# Altium schematic sheet AMS_Slave.SchDoc
size A4; DocumentNumber: 1; SheetNumber: 1; SheetTotal: 6
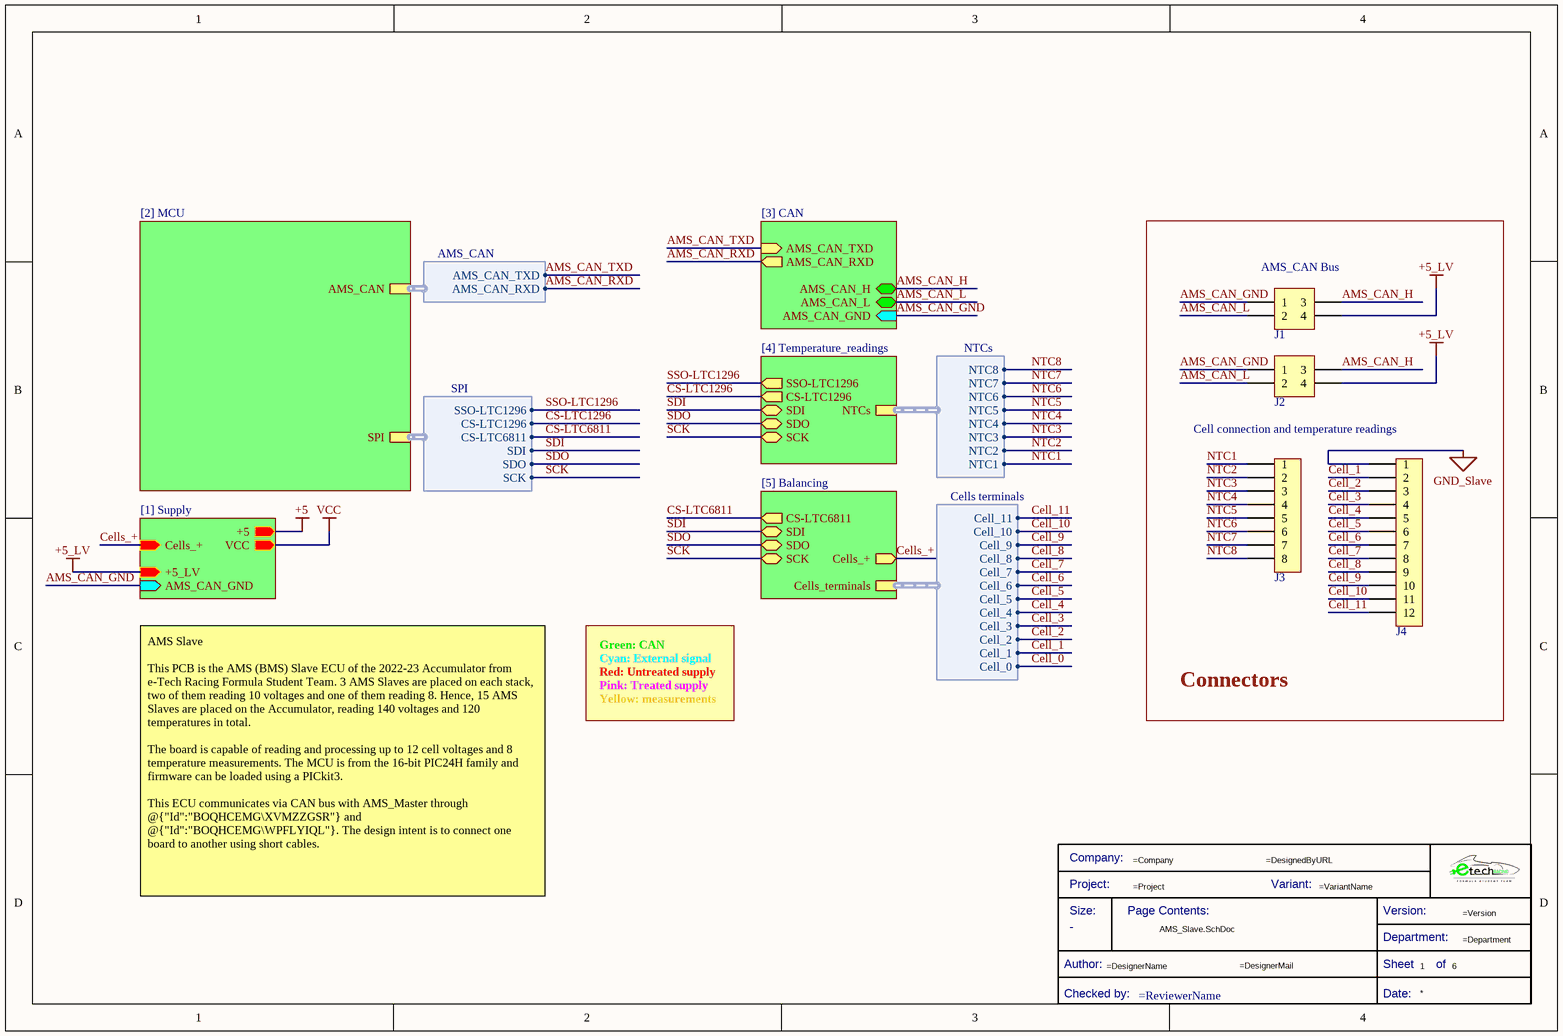
[diagram p0: AMS_Slave.SchDoc]

## Parts
*  Title Block_template  (value not drawn)  (graphical)
J1  430450412  [J_MicroFit_2x2_v]  (value not drawn)
J2  430450412  [J_MicroFit_2x2_v]  (value not drawn)
J3  J_MicroFit_1x8_V  [J_MicroFit_1x8_V]  (value not drawn)
J4  J_MicroFit_1x12_V  [J_MicroFit_1x12_V]  (value not drawn)

## Blocks framed on the sheet
Connectors: J1-J4

## Sub-sheets
Balancing = [5] Balancing: SDI (bidir), SDO (bidir), SCK (bidir), CS-LTC6811 (out), Cells_terminals (harness Cells terminals), Cells_+ (out)
CAN = [3] CAN: AMS_CAN_TXD (in), AMS_CAN_RXD (out), AMS_CAN_H (bidir), AMS_CAN_L (bidir), AMS_CAN_GND (in)
MCU = [2] MCU: AMS_CAN (harness AMS_CAN), SPI (harness SPI)
Supply = [1] Supply: Cells_+ (in), +5 (out), VCC (out), +5_LV (in), AMS_CAN_GND (in)
Temperature_readings = [4] Temperature_readings: CS-LTC1296 (out), SDI (bidir), SDO (bidir), SCK (bidir), SSO-LTC1296 (out), NTCs (harness NTCs)

## Harnesses
AMS_CAN: AMS_CAN_TXD, AMS_CAN_RXD
SPI: SCK, SDI, SDO, SSO-LTC1296, CS-LTC1296, CS-LTC6811
Cells terminals: Cell_0, Cell_1, Cell_10, Cell_11, Cell_2, Cell_3, Cell_4, Cell_5, Cell_6, Cell_7, Cell_8, Cell_9
NTCs: NTC2, NTC3, NTC4, NTC5, NTC6, NTC7, NTC8, NTC1

## Nets
+5: sheet Supply/+5
+5_LV: J1.4 J2.4 ; sheet Supply/+5_LV
GND_Slave: J4.1
VCC: sheet Supply/VCC
AMS_CAN_GND: J1.1 J2.1 ; sheet CAN/AMS_CAN_GND, sheet Supply/AMS_CAN_GND
AMS_CAN_H: J1.3 J2.3 ; sheet CAN/AMS_CAN_H
AMS_CAN_L: J1.2 J2.2 ; sheet CAN/AMS_CAN_L
AMS_CAN_RXD: sheet CAN/AMS_CAN_RXD, sheet MCU/AMS_CAN.AMS_CAN_RXD
AMS_CAN_TXD: sheet CAN/AMS_CAN_TXD, sheet MCU/AMS_CAN.AMS_CAN_TXD
Cell_0: sheet Balancing/Cells_terminals.Cell_0
Cell_1: J4.2 ; sheet Balancing/Cells_terminals.Cell_1
Cell_2: J4.3 ; sheet Balancing/Cells_terminals.Cell_2
Cell_3: J4.4 ; sheet Balancing/Cells_terminals.Cell_3
Cell_4: J4.5 ; sheet Balancing/Cells_terminals.Cell_4
Cell_5: J4.6 ; sheet Balancing/Cells_terminals.Cell_5
Cell_6: J4.7 ; sheet Balancing/Cells_terminals.Cell_6
Cell_7: J4.8 ; sheet Balancing/Cells_terminals.Cell_7
Cell_8: J4.9 ; sheet Balancing/Cells_terminals.Cell_8
Cell_9: J4.10 ; sheet Balancing/Cells_terminals.Cell_9
Cell_10: J4.11 ; sheet Balancing/Cells_terminals.Cell_10
Cell_11: J4.12 ; sheet Balancing/Cells_terminals.Cell_11
Cells_+: sheet Balancing/Cells_+, sheet Supply/Cells_+
CS-LTC1296: sheet Temperature_readings/CS-LTC1296, sheet MCU/SPI.CS-LTC1296
CS-LTC6811: sheet Balancing/CS-LTC6811, sheet MCU/SPI.CS-LTC6811
NTC1: J3.1 ; sheet Temperature_readings/NTCs.NTC1
NTC2: J3.2 ; sheet Temperature_readings/NTCs.NTC2
NTC3: J3.3 ; sheet Temperature_readings/NTCs.NTC3
NTC4: J3.4 ; sheet Temperature_readings/NTCs.NTC4
NTC5: J3.5 ; sheet Temperature_readings/NTCs.NTC5
NTC6: J3.6 ; sheet Temperature_readings/NTCs.NTC6
NTC7: J3.7 ; sheet Temperature_readings/NTCs.NTC7
NTC8: J3.8 ; sheet Temperature_readings/NTCs.NTC8
SCK: sheet Temperature_readings/SCK, sheet Balancing/SCK, sheet MCU/SPI.SCK
SDI: sheet Temperature_readings/SDI, sheet Balancing/SDI, sheet MCU/SPI.SDI
SDO: sheet Temperature_readings/SDO, sheet Balancing/SDO, sheet MCU/SPI.SDO
SSO-LTC1296: sheet Temperature_readings/SSO-LTC1296, sheet MCU/SPI.SSO-LTC1296

## Notes on the sheet
- (near J1) AMS_CAN Bus
- Cell connection and temperature readings
- Green: CAN
- Cyan: External signal
- Red: Untreated supply
- Yellow: measurements
- Pink: Treated supply
- AMS Slave
  This PCB is the AMS (BMS) Slave ECU of the 2022-23 Accumulator from e-Tech Racing Formula Student Team. 3 AMS Slaves are placed on each stack, two of them reading 10 voltages and one of them reading 8. Hence, 15 AMS Slaves are placed on the Accumulator, reading 140 voltages and 120 temperatures in total.
  The board is capable of reading and processing up to 12 cell voltages and 8 temperature measurements. The MCU is from the 16-bit PIC24H family and firmware can be loaded using a PICkit3.
  This ECU communicates via CAN bus with AMS_Master through @{"Id":"BOQHCEMG\XVMZZGSR"} and @{"Id":"BOQHCEMG\WPFLYIQL"}. The design intent is to connect one board to another using short cables.
- Title
- Size:
- Date:
- A4
- Number:
- Time:
- Revision:
- Sheet
- of
- File:
- (in symbol Title Block_template) Company:; Project:; Variant:; Size:; Page Contents:; Version:; Department:; Author:; Sheet; of; Checked by:; Date:

## Library data of the parts
* = Title Block_template: Standard Title Block; Category: Title Block; Checked by:: =ReviewerName; Size: -
J1 J2 = J_MicroFit_2x2: Header 2 Row Vertical Polarizing Peg 4 Pin Tin Plate SMT/Glow Wire Kinked Leads; Manufacturer 1: Molex; Manufacturer Part Number 1: 43045-0412; .Creator: DR; Supplier 1: Arrow Electronics; RoHS: Yes; Category: Headers and Wire Housings; Stock 1: 54122; Pricing 1: 1=1,24720, 10=1,02970, 80=0,85390, 2232=0,63810, 6696=0,59030, 11160=0,55550 (USD); ComponentLink1URL: https://datasheet.ciiva.com/19462/883368-19462265.pdf?src-supplier=Jameco; ComponentLink1Description: https://datasheet.ciiva.com/19462/883368-19462265.pdf?src-supplier=Jameco; ComponentLink2URL: https://datasheet.ciiva.com/5158/0430450412-pcb-headers-142874-5158187.pdf?src-supplier=Mouser; ComponentLink2Description: https://datasheet.ciiva.com/5158/0430450412-pcb-headers-142874-5158187.pdf?src-supplier=Mouser; ComponentLink3URL: https://datasheet.ciiva.com/30095/176640430450412-pcb-headers-30095929.pdf?src-supplier=Onlinecomponents.com; ComponentLink3Description: https://datasheet.ciiva.com/30095/176640430450412-pcb-headers-30095929.pdf?src-supplier=Onlinecomponents.com; ComponentLink4URL: https://datasheet.ciiva.com/11747/0900766b800bd7d2-11747137.pdf?src-supplier=RSComponents; ComponentLink4Description: https://datasheet.ciiva.com/11747/0900766b800bd7d2-11747137.pdf?src-supplier=RSComponents; ComponentLink5URL: https://datasheet.ciiva.com/26916/getdatasheetpartid-253008-26916516.pdf?src-supplier=Verical; ComponentLink5Description: https://datasheet.ciiva.com/26916/getdatasheetpartid-253008-26916516.pdf?src-supplier=Verical; ComponentLink6URL: https://datasheet.ciiva.com/22637/1928349-22637530.pdf?src-supplier=Element14; ComponentLink6Description: https://datasheet.ciiva.com/22637/1928349-22637530.pdf?src-supplier=Element14; ComponentLink7URL: https://datasheet.ciiva.com/9468/0430450412-pcb-headers-9468485.pdf?src-supplier=Avnet; ComponentLink7Description: https://datasheet.ciiva.com/9468/0430450412-pcb-headers-9468485.pdf?src-supplier=Avnet; Supplier Part Number 1: 43045-0412
J3 = J_MicroFit_1x8_V: Conn Wire to Board HDR 8 POS 3mm Solder ST Top Entry Thru-Hole Micro-Fit 3.0™ Tray; Manufacturer 1: Molex; Manufacturer Part Number 1: 43650-1200; .Creator: DR; Supplier 1: Newark; RoHS: Yes; Category: Headers and Wire Housings; Stock 1: 13; Pricing 1: 1=3,36000, 10=2,96000, 25=2,76000, 50=2,56000, 100=2,36000, 250=2,08000 (USD); Supplier Part Number 1: 01AH1239; Supplier 2: Arrow Electronics; Manufacturer 2: Molex; Manufacturer Part Number 2: 43650-0815; Stock 2: 2244; Pricing 2: 1=1,89510, 10=1,68890, 80=1,45980, 1122=1,20850, 5610=1,08880 (USD); Supplier Part Number 2: 43650-0815; ComponentLink1URL: https://datasheet.ciiva.com/16085/281240436500815-pcb-headers-16085998.pdf?src-supplier=Onlinecomponents.com; ComponentLink1Description: https://datasheet.ciiva.com/16085/281240436500815-pcb-headers-16085998.pdf?src-supplier=Onlinecomponents.com; ComponentLink2URL: https://datasheet.ciiva.com/5151/0436500815-pcb-headers-148729-5151340.pdf?src-supplier=Mouser; ComponentLink2Description: https://datasheet.ciiva.com/5151/0436500815-pcb-headers-148729-5151340.pdf?src-supplier=Mouser; ComponentLink3URL: https://datasheet.ciiva.com/26916/getdatasheetpartid-78997-26916336.pdf?src-supplier=Verical; ComponentLink3Description: https://datasheet.ciiva.com/26916/getdatasheetpartid-78997-26916336.pdf?src-supplier=Verical; ComponentLink4URL: https://datasheet.ciiva.com/30117/57400436500815-pcb-headers-30117736.pdf?src-supplier=Onlinecomponents.com; ComponentLink4Description: https://datasheet.ciiva.com/30117/57400436500815-pcb-headers-30117736.pdf?src-supplier=Onlinecomponents.com
J4 = J_MicroFit_1x12_V: Conn Power HDR 12 POS 3mm Solder ST Thru-Hole 12 Terminal 1 Port Micro-Fit 3.0™ Tray; Manufacturer 1: Molex; Manufacturer Part Number 1: 43650-1215; Supplier 1: Avnet; RoHS: Yes; Category: Headers and Wire Housings; Stock 1: 1632; Pricing 1: 816=1,58731, 1632=1,28652, 3264=1,08716, 4896=1,05565, 6528=0,89063 (USD); ComponentLink1URL: https://datasheet.ciiva.com/712/436500316-sd-712050.pdf?src-supplier=Digi-Key; ComponentLink1Description: https://datasheet.ciiva.com/712/436500316-sd-712050.pdf?src-supplier=Digi-Key; ComponentLink2URL: https://datasheet.ciiva.com/5154/0436501215-pcb-headers-148827-5154953.pdf?src-supplier=Mouser; ComponentLink2Description: https://datasheet.ciiva.com/5154/0436501215-pcb-headers-148827-5154953.pdf?src-supplier=Mouser; ComponentLink3URL: https://datasheet.ciiva.com/16088/0436501215-pcb-headers-16088773.pdf?src-supplier=Onlinecomponents.com; ComponentLink3Description: https://datasheet.ciiva.com/16088/0436501215-pcb-headers-16088773.pdf?src-supplier=Onlinecomponents.com; ComponentLink4URL: https://datasheet.ciiva.com/30150/206240436501215-pcb-headers-30150375.pdf?src-supplier=Onlinecomponents.com; ComponentLink4Description: https://datasheet.ciiva.com/30150/206240436501215-pcb-headers-30150375.pdf?src-supplier=Onlinecomponents.com; Supplier Part Number 1: 0436501215